# Altium schematic sheet AeroPressureSensor.SchDoc
size A
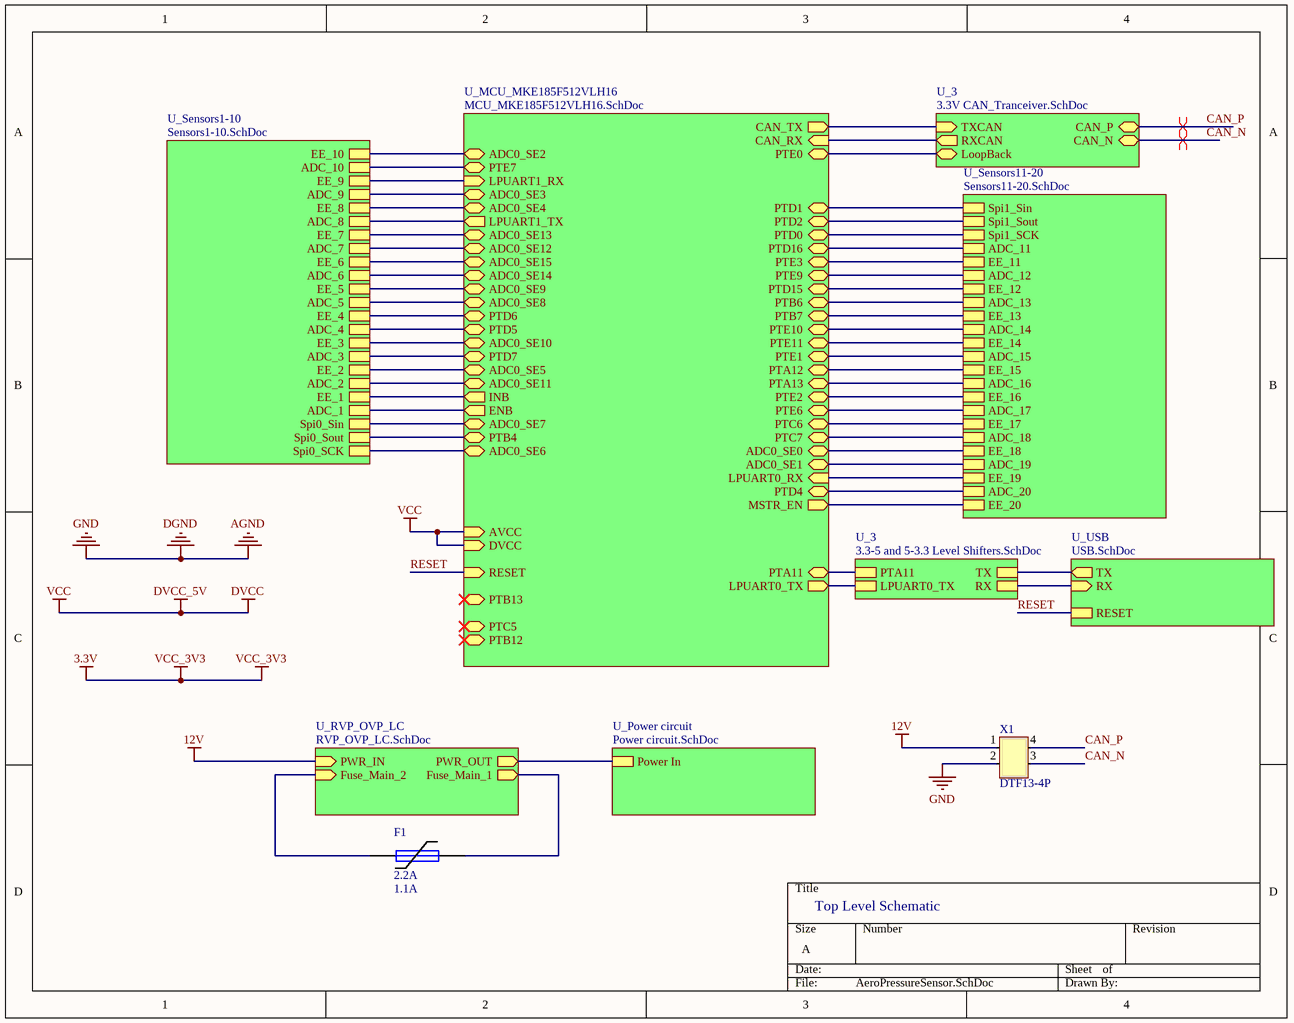
[diagram p0: AeroPressureSensor.SchDoc]

## Parts
F1  2.2A  I_hold: 1.1A  [PTC Fuse 1206/3216]
X1  DTF13-4P  [DTF13-4P]

## Sub-sheets
U_3 = 3.3V CAN_Tranceiver.SchDoc: TXCAN (in), RXCAN (out), CAN_P (bidir), CAN_N (bidir), LoopBack (bidir)
U_3 = 3.3-5 and 5-3.3 Level Shifters.SchDoc: LPUART0_TX, RX, TX, PTA11
U_MCU_MKE185F512VLH16 = MCU_MKE185F512VLH16.SchDoc: CAN_TX (out), CAN_RX (in), INB (out), ENB (out), ADC0_SE11 (bidir), ADC0_SE10 (bidir), ADC0_SE9 (bidir), ADC0_SE8 (bidir), ADC0_SE15 (bidir), ADC0_SE14 (bidir), ADC0_SE13 (bidir), ADC0_SE12 (bidir), ADC0_SE7 (bidir), ADC0_SE6 (bidir), ADC0_SE1 (bidir), ADC0_SE0 (bidir), LPUART0_TX (out), LPUART0_RX (in), MSTR_EN (out), ADC0_SE5 (bidir), ADC0_SE4 (bidir), LPUART1_TX (out), LPUART1_RX (in), ADC0_SE3 (bidir), ADC0_SE2 (bidir), DVCC (in), AVCC (in), PTD5 (bidir), PTD6 (bidir), PTD7 (bidir), PTB4 (bidir), PTE9 (bidir), PTD15 (bidir), PTD16 (bidir), PTE3 (bidir), PTB6 (bidir), PTB7 (bidir), PTE10 (bidir), PTE11 (bidir), PTD0 (bidir), PTD1 (bidir), PTC7 (bidir), PTC6 (bidir), PTE6 (bidir), PTE2 (bidir), PTA13 (bidir), PTA12 (bidir), PTA11 (bidir), PTE1 (bidir), PTE0 (bidir), RESET (in), PTD2 (bidir), PTD4 (bidir), PTB13 (bidir), PTB12 (bidir), PTE7 (bidir), PTC5 (bidir)
U_Power circuit = Power circuit.SchDoc: Power In
U_RVP_OVP_LC = RVP_OVP_LC.SchDoc: PWR_IN (in), Fuse_Main_2 (in), Fuse_Main_1 (out), PWR_OUT (out)
U_Sensors1-10 = Sensors1-10.SchDoc: EE_1, Spi0_Sin, Spi0_SCK, Spi0_Sout, ADC_1, ADC_2, EE_2, EE_3, ADC_3, ADC_4, EE_4, EE_5, ADC_5, ADC_6, EE_6, EE_7, ADC_7, ADC_8, EE_8, EE_9, ADC_9, ADC_10, EE_10
U_Sensors11-20 = Sensors11-20.SchDoc: EE_11, Spi1_Sin, Spi1_SCK, Spi1_Sout, ADC_11, ADC_12, EE_12, EE_13, ADC_13, ADC_14, EE_14, EE_15, ADC_15, ADC_16, EE_16, EE_17, ADC_17, ADC_18, EE_18, EE_19, ADC_19, ADC_20, EE_20
U_USB = USB.SchDoc: TX (out), RX (in), RESET

## Nets
12V: X1.1 ; sheet U_RVP_OVP_LC/PWR_IN
AGND: X1.2  [also labelled DGND, GND]
DVCC: sheet U_MCU_MKE185F512VLH16/DVCC, sheet U_MCU_MKE185F512VLH16/AVCC  [also labelled DVCC_5V, VCC]
CAN_N: X1.3 ; sheet U_3/CAN_N
CAN_P: X1.4 ; sheet U_3/CAN_P
RESET: sheet U_MCU_MKE185F512VLH16/RESET, sheet U_USB/RESET
NetF1_1: F1.1 ; sheet U_RVP_OVP_LC/Fuse_Main_2
NetF1_2: F1.2 ; sheet U_RVP_OVP_LC/Fuse_Main_1
(unnamed): sheet U_MCU_MKE185F512VLH16/CAN_TX, sheet U_3/TXCAN
(unnamed): sheet U_MCU_MKE185F512VLH16/CAN_RX, sheet U_3/RXCAN
(unnamed): sheet U_MCU_MKE185F512VLH16/INB, sheet U_Sensors1-10/EE_1
(unnamed): sheet U_MCU_MKE185F512VLH16/ENB, sheet U_Sensors1-10/ADC_1
(unnamed): sheet U_MCU_MKE185F512VLH16/ADC0_SE11, sheet U_Sensors1-10/ADC_2
(unnamed): sheet U_MCU_MKE185F512VLH16/ADC0_SE10, sheet U_Sensors1-10/EE_3
(unnamed): sheet U_MCU_MKE185F512VLH16/ADC0_SE9, sheet U_Sensors1-10/EE_5
(unnamed): sheet U_MCU_MKE185F512VLH16/ADC0_SE8, sheet U_Sensors1-10/ADC_5
(unnamed): sheet U_MCU_MKE185F512VLH16/ADC0_SE15, sheet U_Sensors1-10/EE_6
(unnamed): sheet U_MCU_MKE185F512VLH16/ADC0_SE14, sheet U_Sensors1-10/ADC_6
(unnamed): sheet U_MCU_MKE185F512VLH16/ADC0_SE13, sheet U_Sensors1-10/EE_7
(unnamed): sheet U_MCU_MKE185F512VLH16/ADC0_SE12, sheet U_Sensors1-10/ADC_7
(unnamed): sheet U_MCU_MKE185F512VLH16/ADC0_SE7, sheet U_Sensors1-10/Spi0_Sin
(unnamed): sheet U_MCU_MKE185F512VLH16/ADC0_SE6, sheet U_Sensors1-10/Spi0_SCK
(unnamed): sheet U_MCU_MKE185F512VLH16/ADC0_SE1, sheet U_Sensors11-20/ADC_19
(unnamed): sheet U_MCU_MKE185F512VLH16/ADC0_SE0, sheet U_Sensors11-20/EE_18
(unnamed): sheet U_MCU_MKE185F512VLH16/LPUART0_TX, sheet U_3/LPUART0_TX
(unnamed): sheet U_MCU_MKE185F512VLH16/LPUART0_RX, sheet U_Sensors11-20/EE_19
(unnamed): sheet U_MCU_MKE185F512VLH16/MSTR_EN, sheet U_Sensors11-20/EE_20
(unnamed): sheet U_MCU_MKE185F512VLH16/ADC0_SE5, sheet U_Sensors1-10/EE_2
(unnamed): sheet U_MCU_MKE185F512VLH16/ADC0_SE4, sheet U_Sensors1-10/EE_8
(unnamed): sheet U_MCU_MKE185F512VLH16/LPUART1_TX, sheet U_Sensors1-10/ADC_8
(unnamed): sheet U_MCU_MKE185F512VLH16/LPUART1_RX, sheet U_Sensors1-10/EE_9
(unnamed): sheet U_MCU_MKE185F512VLH16/ADC0_SE3, sheet U_Sensors1-10/ADC_9
(unnamed): sheet U_MCU_MKE185F512VLH16/ADC0_SE2, sheet U_Sensors1-10/EE_10
(unnamed): sheet U_MCU_MKE185F512VLH16/PTD5, sheet U_Sensors1-10/ADC_4
(unnamed): sheet U_MCU_MKE185F512VLH16/PTD6, sheet U_Sensors1-10/EE_4
(unnamed): sheet U_MCU_MKE185F512VLH16/PTD7, sheet U_Sensors1-10/ADC_3
(unnamed): sheet U_MCU_MKE185F512VLH16/PTB4, sheet U_Sensors1-10/Spi0_Sout
(unnamed): sheet U_MCU_MKE185F512VLH16/PTE9, sheet U_Sensors11-20/ADC_12
(unnamed): sheet U_MCU_MKE185F512VLH16/PTD15, sheet U_Sensors11-20/EE_12
(unnamed): sheet U_MCU_MKE185F512VLH16/PTD16, sheet U_Sensors11-20/ADC_11
(unnamed): sheet U_MCU_MKE185F512VLH16/PTE3, sheet U_Sensors11-20/EE_11
(unnamed): sheet U_MCU_MKE185F512VLH16/PTB6, sheet U_Sensors11-20/ADC_13
(unnamed): sheet U_MCU_MKE185F512VLH16/PTB7, sheet U_Sensors11-20/EE_13
(unnamed): sheet U_MCU_MKE185F512VLH16/PTE10, sheet U_Sensors11-20/ADC_14
(unnamed): sheet U_MCU_MKE185F512VLH16/PTE11, sheet U_Sensors11-20/EE_14
(unnamed): sheet U_MCU_MKE185F512VLH16/PTD0, sheet U_Sensors11-20/Spi1_SCK
(unnamed): sheet U_MCU_MKE185F512VLH16/PTD1, sheet U_Sensors11-20/Spi1_Sin
(unnamed): sheet U_MCU_MKE185F512VLH16/PTC7, sheet U_Sensors11-20/ADC_18
(unnamed): sheet U_MCU_MKE185F512VLH16/PTC6, sheet U_Sensors11-20/EE_17
(unnamed): sheet U_MCU_MKE185F512VLH16/PTE6, sheet U_Sensors11-20/ADC_17
(unnamed): sheet U_MCU_MKE185F512VLH16/PTE2, sheet U_Sensors11-20/EE_16
(unnamed): sheet U_MCU_MKE185F512VLH16/PTA13, sheet U_Sensors11-20/ADC_16
(unnamed): sheet U_MCU_MKE185F512VLH16/PTA12, sheet U_Sensors11-20/EE_15
(unnamed): sheet U_MCU_MKE185F512VLH16/PTA11, sheet U_3/PTA11
(unnamed): sheet U_MCU_MKE185F512VLH16/PTE1, sheet U_Sensors11-20/ADC_15
(unnamed): sheet U_MCU_MKE185F512VLH16/PTE0, sheet U_3/LoopBack
(unnamed): sheet U_MCU_MKE185F512VLH16/PTD2, sheet U_Sensors11-20/Spi1_Sout
(unnamed): sheet U_MCU_MKE185F512VLH16/PTD4, sheet U_Sensors11-20/ADC_20
(unnamed): sheet U_MCU_MKE185F512VLH16/PTE7, sheet U_Sensors1-10/ADC_10
(unnamed): sheet U_USB/TX, sheet U_3/TX
(unnamed): sheet U_USB/RX, sheet U_3/RX
(unnamed): sheet U_RVP_OVP_LC/PWR_OUT, sheet U_Power circuit/Power In

## Layout directives
differential pair: CAN_N, CAN_P

## Notes on the sheet
- Top Level Schematic

## Library data of the parts
F1 = 8: Fuse; Manufacturer_id: 1; MfrPartNo: 1206L110/12SLYR; idFuse: 8; Name: Resettable; I_max: 50A; V_max: 12V; Pd_Typ: .8W; Published: 8-Jun-2000; LatestRevisionDate: 17-Jul-2002; LatestRevisionNote: Re-released for DXP Platform.; PackageReference: PIN-W2/E2.8; Publisher: Altium Limited; PackageDescription: Thru-Hole; 2 Leads; Drawer_id: 1; I_trip: 2.2A; Link: https://www.digikey.com/product-detail/en/littelfuse-inc/1206L110-12SLYR/F5764CT-ND/3593809
X1 = 15: 2 row 4 pin Board; Manufacturer_id: 1; idConn: 15; Value: CONN; Num_Contacts: 4; Created_By: Angel; MfrPartNo: DTF13-4P; Drawer_id: 1; Name: DTF13-4P; Link: https://www.te.com/usa-en/product-DTF13-4P.html; ComponentLink1Description: Datasheet; Supplier1: TE